# Altium schematic sheet Simple_Project.SchDoc: Simple Project
size A4; Author: Prawin Kumar J S; DrawnBy: Prawin Kumar J S; Engineer: PRAWIN KUMAR JS; SheetNumber: 1; SheetTotal: 1
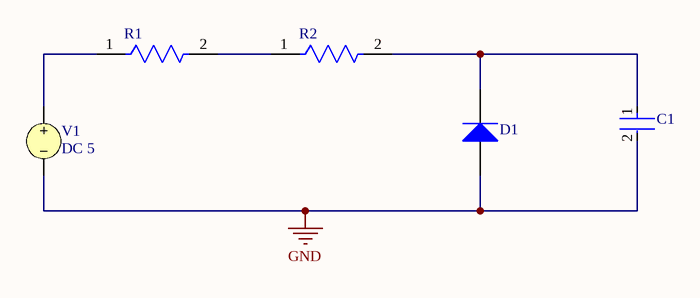
[diagram p0: Simple_Project.SchDoc]

## Parts
C1  GRM188R60J106ME47D  [FP-GRM188-0_1-e0_2_0_55-IPC_A]  (value not drawn)
D1  FDLL4148  [FAIR-LL-34_V]  (value not drawn)
R1  MRS25000C1001FCT00  [FP-MRS25-MFG]  (value not drawn)
R2  MRS25000C1001FCT00  [FP-MRS25-MFG]  (value not drawn)
V1  DC 5

## Nets
GND: C1.2 D1.1(A) V1.2
NetC1_1: C1.1 D1.2(K) R2.2
NetR1_1: R1.1 V1.1
NetR1_2: R1.2 R2.1

## Library data of the parts
C1 = CMP-2006-02792-2: Chip Multilayer Ceramic Capacitors for General Purpose, 0603, 10uF, X5R, 15%, 20%, 6.3V; Packaging: Tape and Reel; Voltage Rating (DC): 6.3V; Width: 0.031inch; Termination: SMD/SMT; Dielectric: X5R; Package Quantity: 4000; Voltage Rating: 6.3V; Capacitance: 10uF; Case/Package: 0603; Min Operating Temperature: -55°C; Voltage: 6.3V; Length: 1.6mm; Thickness: 0.035inch; Lead Free: Lead Free; Depth: 0.8mm; Case Code (Imperial): 0603; Max Operating Temperature: 85°C; Material: Ceramic; Height: 0.8mm; Tolerance: 20%; Mount: Surface Mount; REACH SVHC: No SVHC; Radiation Hardening: No; Case Code (Metric): 1608
D1 = CMP-2000-05112-2: High Conductance Fast Diode, 500 mW, 100 V, -65 to 175 degC, 2-Pin SMD, RoHS, Tape and Reel; Manufacturer: FairchildSemiconductor; Peak Average Forward Current: 0.3A; Peak Forward Voltage: 1@0.01AV; Peak Reverse Repetitive Voltage: 100V; Rad Hard: No; Type: SmallSignalSwitchingDiode; Peak Reverse Recovery Time: 4ns; Configuration: Single; Peak Reverse Current: 5@75VuA; Peak Non-Repetitive Surge Current: 4A; Operating Temperature: -65to175degC; Datasheet Version: Nov-96; Datasheet URL: https://datasheet.ciiva.com/8053/30071-8053638.pdf; Manufacturer URL: https://www.fairchildsemi.com/; Category: Rectifier; Package URL: https://www.fairchildsemi.com/package-drawings/SO/SOD80A.pdf; Package Description: 2-Leads SOD, Body 3.6x1.5mm; Mounting: SurfaceMount; Packaging: Tape&Reel; Package: 2LL-34
R1 R2 = CMP-02408-000051-1: RES 1K OHM 0.6W 1% AXIAL; Power Rating: 600mW; Lead Diameter: 0.6mm; Voltage Rating (DC): 350V; Resistance: 1kR; Temperature Coefficient: 50ppm/°C; Width: 2.5mm; Military Standard: Not; Package Quantity: 5000; Radiation Hardening: No; Case/Package: Axial; Resistance Tolerance: 1%; Resistor Type: Metal Film; Contact Plating: Tin; Length: 6.5mm; Lead Free: Lead Free; RoHS Compliant: Yes; Mount: Through Hole; Number of Pins: 2; Technology: THIN FILM; Voltage Rating: 350V; Min Operating Temperature: -55°C; Weight: 0.00776oz; Diameter: 2.5mm; Construction: Cylindrical; Series: MRS25; Tolerance: 1%; Packaging: Tape and Reel; Max Operating Temperature: 155°C; Max Power Dissipation: 600mW; Number of Terminations: 2; Termination: Axial
V1 = VSRC: Voltage Source; Note: PCB Footprint - Not required; AC Magnitude: 1; AC Phase: 0; Value: 5; Published: 8-Jun-2000; LatestRevisionDate: 17-Jul-2002; LatestRevisionNote: Re-released for DXP Platform.; PackageReference: Not Applicable; Publisher: Altium Limited